# Altium schematic sheet Base_plate.SchDoc
size 420 x 297 mm; SPICEModelCacheWQQPEAYJ: <root> / <DocumentId>WQQPEAYJ</DocumentId> / </root>; ФИО: Соловцов М.А.; название: Плата управления; орг: МГТУ им. Н.Э Баумана; колич: 1; орг1: группа СМ7-71Б; дец: СМ7.00.01.00 Э3
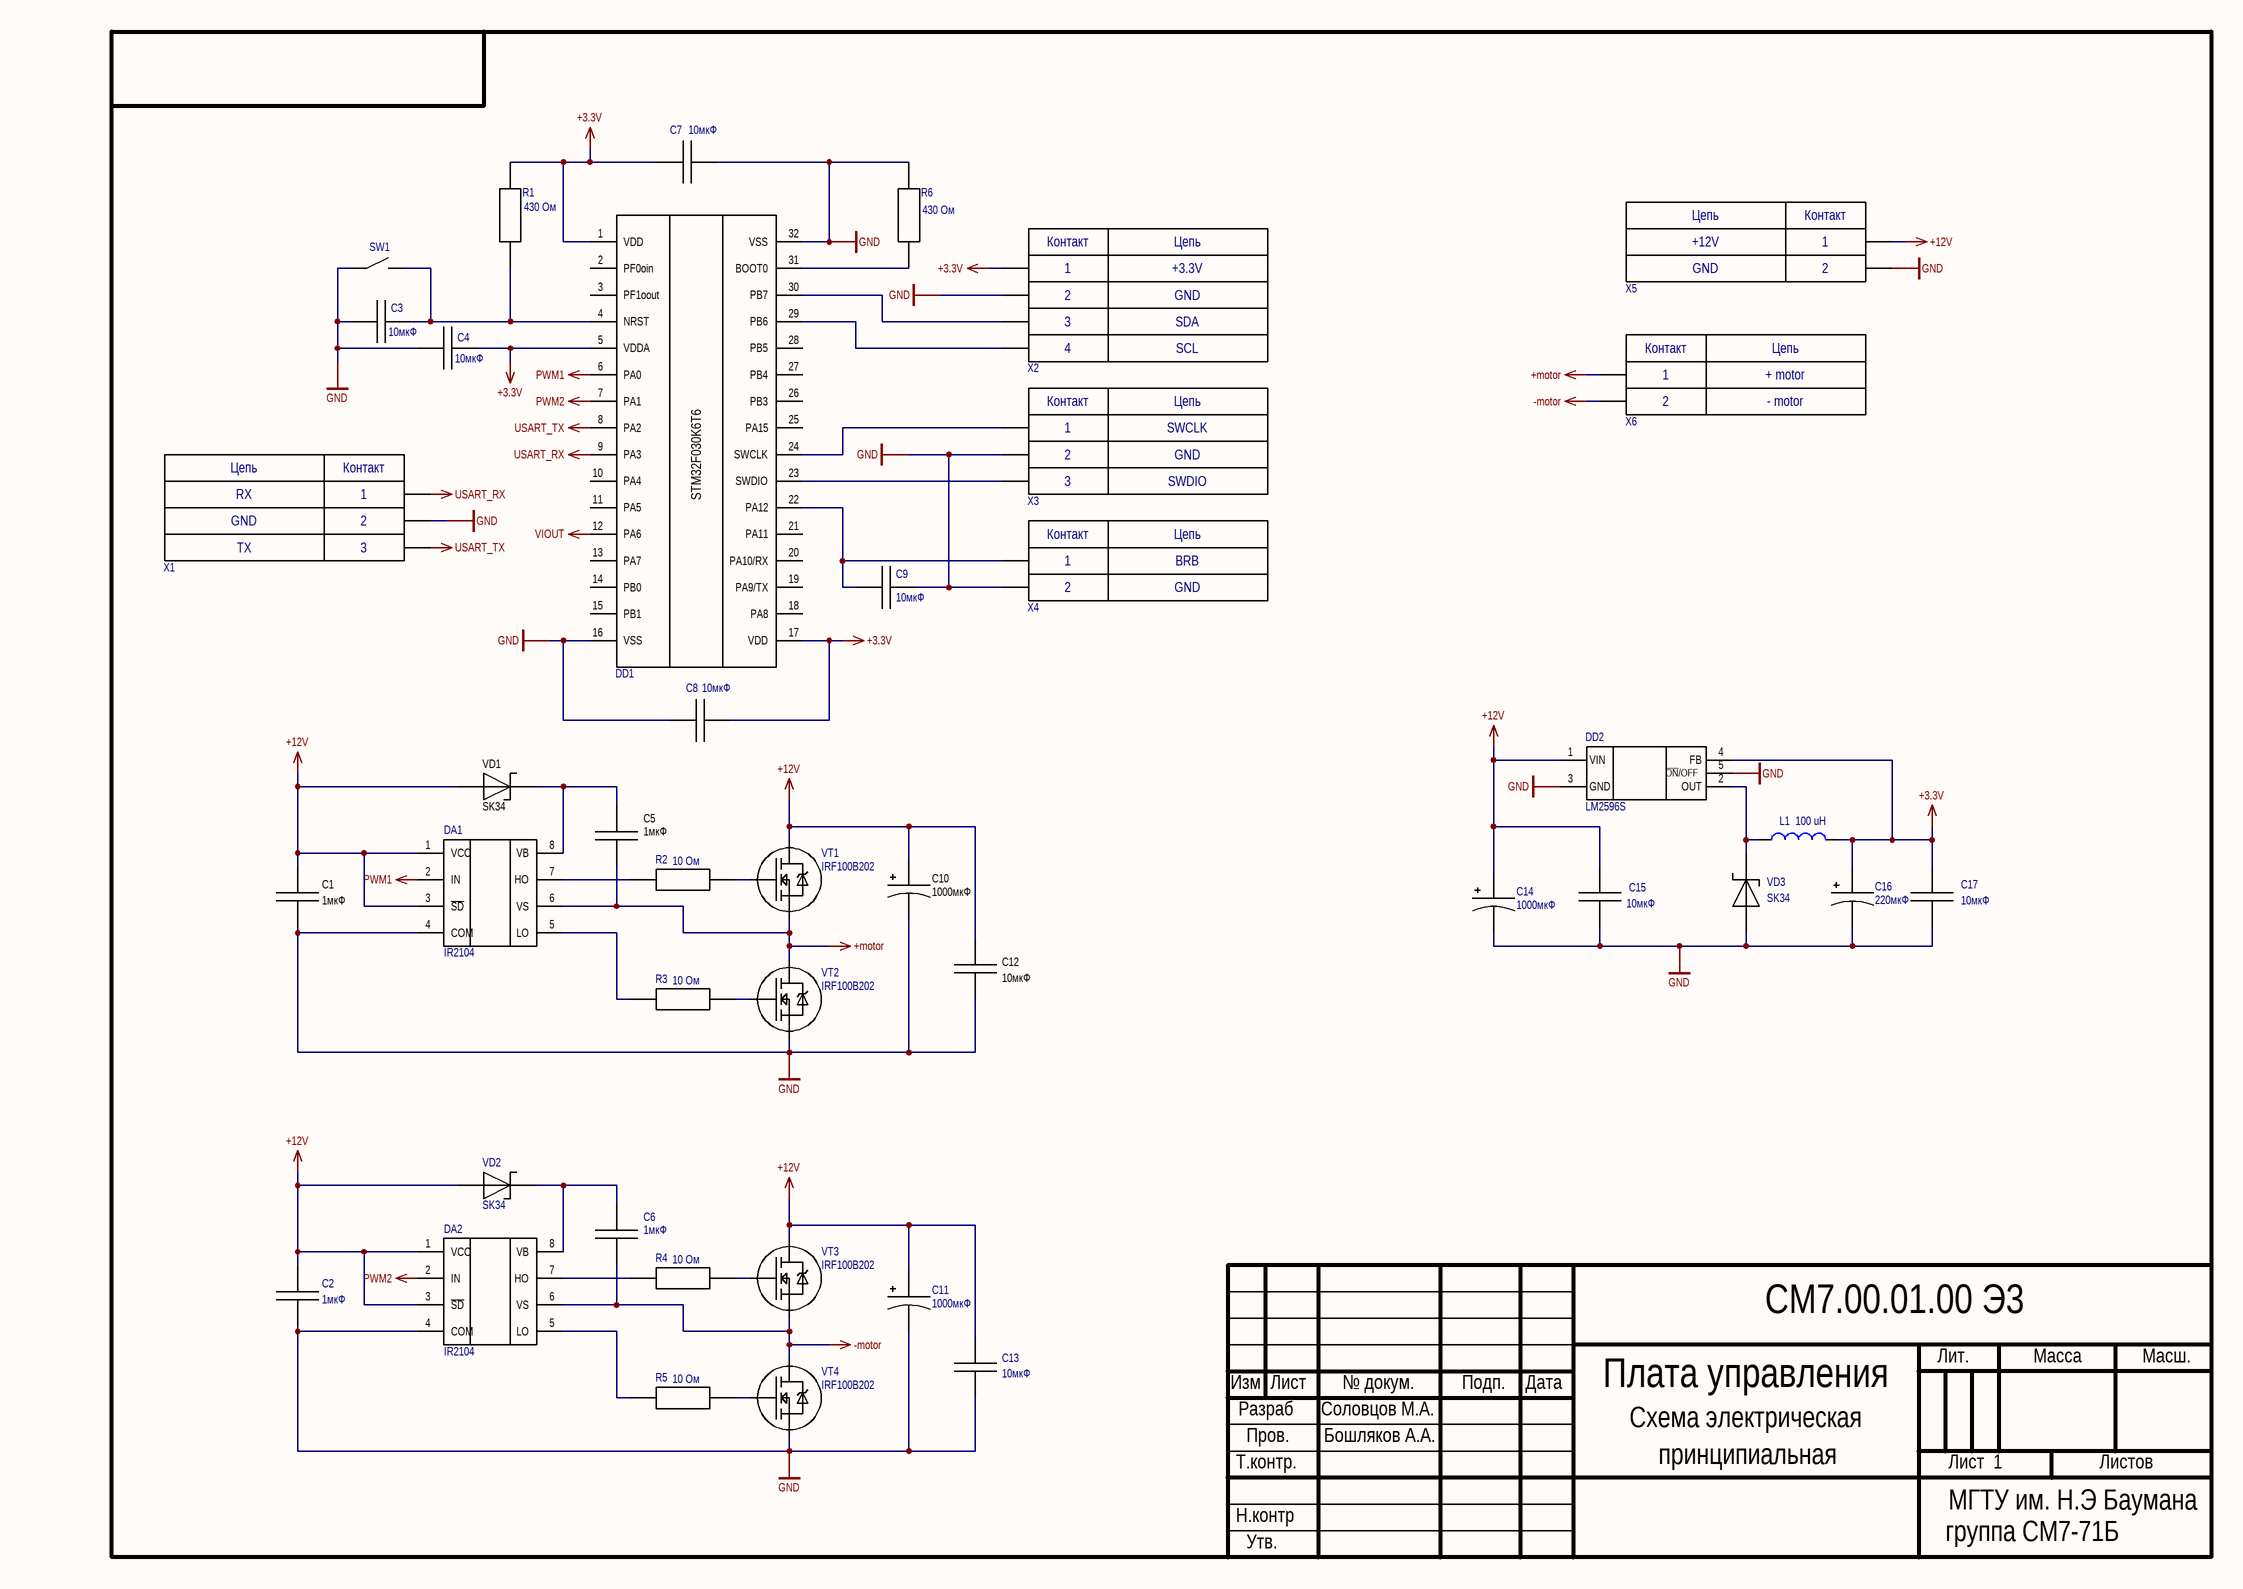
[diagram p0: Base_plate.SchDoc]

## Parts
C1  1мкФ  [CAP 10 uF]
C2  1мкФ  [CAP 10 uF]
C3  10мкФ  [CAP 10 uF]
C4  10мкФ  [CAP 10 uF]
C5  1мкФ  [CAP 10 uF]
C6  1мкФ  [CAP 10 uF]
C7  10мкФ  [CAP 10 uF]
C8  10мкФ  [CAP 10 uF]
C9  10мкФ  [CAP 10 uF]
C10  1000мкФ  [cap 1000]
C11  1000мкФ  [cap 1000]
C12  10мкФ  [CAP 10 uF]
C13  10мкФ  [CAP 10 uF]
C14  1000мкФ  [cap 1000]
C15  10мкФ  [CAP 10 uF]
C16  220мкФ  [Capacitor 220nF E]
C17  10мкФ  [CAP 10 uF]
DA1  IR2104  [IR2104]
DA2  IR2104  [IR2104]
DD1  STM32F030K6T6  [QFP32(7x7)]  (value not drawn)
DD2  LM2596S  [LM2596]
L1  value 100 uH  [INDUCTOR]  (hidden comment: Inductor)
R1  value 430 Ом  [0402]  (hidden comment: 430R)
R2  value 10 Ом  [0402]  (hidden comment: Resistor)
R3  value 10 Ом  [0402]  (hidden comment: Resistor)
R4  value 10 Ом  [0402]  (hidden comment: Resistor)
R5  value 10 Ом  [0402]  (hidden comment: Resistor)
R6  value 430 Ом  [0402]  (hidden comment: 430R)
SW1  Button  [button]  (value not drawn)
VD1  SK34  [SK34]
VD2  SK34  [SK34]
VD3  SK34  [SK34]
VT1  IRF100B202  [TO-220AB]
VT2  IRF100B202  [TO-220AB]
VT3  IRF100B202  [TO-220AB]
VT4  IRF100B202  [TO-220AB]
X1  3pin  [3pin]  (value not drawn)
X2  4pin  [4pin]  (value not drawn)
X3  3pin  [3pin]  (value not drawn)
X4  2pin  [2pin5mmVintKlemm]  (value not drawn)
X5  2pin  [2pin5mmVintKlemm]  (value not drawn)
X6  2pin  [2pin5mmVintKlemm]  (value not drawn)

## Nets
+3.3V: C4.2 C7.1 C8.2 C16.1 C17.1 DD1.1(VDD) DD1.5(VDDA) DD1.17(VDD) DD2.4(FB) L1.2 R1.2 X2.1
+12V: C1.2 C2.2 C10.1 C11.1 C12.1 C13.1 C14.1 C15.1 DA1.1(VCC) DA1.3(~{SD}) DA2.1(VCC) DA2.3(~{SD}) DD2.1(VIN) VD1.1 VD2.1 VT1.2 VT3.2 X5.1
+motor: C5.1 DA1.6(VS) VT1.3 VT2.2 X6.1
-motor: C6.1 DA2.6(VS) VT3.3 VT4.2 X6.2(-Vout)
GND: C1.1 C2.1 C3.1 C4.1 C7.2 C8.1 C9.2 C10.2 C11.2 C12.2 C13.2 C14.2 C15.2 C16.2 C17.2 DA1.4(COM) DA2.4(COM) DD1.16(VSS) DD1.32(VSS) DD2.3(GND) DD2.5(~{ON}/OFF) R6.2 SW1.1(G) VD3.1 VT2.3 VT4.3 X1.2(-Vout) X2.2(-Vout) X3.2(-Vout) X4.2(-Vout) X5.2(-Vout)
PWM1: DA1.2(IN) DD1.6(PA0)
PWM2: DA2.2(IN) DD1.7(PA1)
USART_RX: DD1.9(PA3) X1.1
USART_TX: DD1.8(PA2) X1.3(-Vout)
VIOUT: DD1.12(PA6)
NetC3_2: C3.2 DD1.4(NRST) R1.1 SW1.2(G)
NetC5_2: C5.2 DA1.8(VB) VD1.2
NetC6_2: C6.2 DA2.8(VB) VD2.2
NetC9_1: C9.1 DD1.22(PA12) X4.1
NetDA1_5: DA1.5(LO) R3.1
NetDA1_7: DA1.7(HO) R2.1
NetDA2_5: DA2.5(LO) R5.1
NetDA2_7: DA2.7(HO) R4.1
NetDD1_23: DD1.23(SWDIO) X3.3(-Vout)
NetDD1_24: DD1.24(SWCLK) X3.1
NetDD1_29: DD1.29(PB6) X2.4(-Vout)
NetDD1_30: DD1.30(PB7) X2.3(-Vout)
NetDD1_31: DD1.31(BOOT0) R6.1
NetDD2_2: DD2.2(OUT) L1.1 VD3.2
NetR2_2: R2.2 VT1.1
NetR3_2: R3.2 VT2.1
NetR4_2: R4.2 VT3.1
NetR5_2: R5.2 VT4.1

Not connected (* = marked no-connect by the designer): DD1 2(PF0oin) 3(PF1oout) 10(PA4) 11(PA5) 13(PA7) 14(PB0) 15(PB1) 18(PA8) 19(PA9/TX) 20(PA10/RX) 21(PA11) 25(PA15) 26(PB3) 27(PB4) 28(PB5)

## Notes on the sheet
- Изм
- Лист
- № докум.
- Подп.
- Дата
- Лит.
- Масса
- Масш.
- Т.контр.
- Разраб
- Пров.
- Бошляков А.А.
- Схема электрическая
- принципиальная
- Листов
- Н.контр
- Утв.
- (in symbol 2pin) Контакт; Цепь
- (in symbol 3pin) Контакт; Цепь
- (in symbol 4pin_1) Контакт; Цепь

## Library data of the parts
C1 C2 C5 C6 = Capacitor 0805: GRM21BR71H105K; Parameter 1: *
C3 C4 C7-C9 C12 C13 C15 C17 = Capacitor 0805: 0805X106K350SNT; Parameter 1: *
C10 C11 C14 = Capacitor  El
C16 = CAPACIATOR E D6.3
L1 = Inductor: Code_IEC: 1005; Published: 8-Jun-2000; LatestRevisionDate: 29-May-2009; LatestRevisionNote: IPC-7351 Footprint Added.; PackageReference: 0402-A; Publisher: Altium Limited; PackageDescription: Chip Inductor; Code_JEITA: 0402
R1-R6 = Resistor: TU: ШКАБ.434110.002ТУ; Reference: *
VT1-VT4 = IRF3205PBF: N-Channel 55V 110A _Tc_ 200W _Tc_ Through Hole TO-220AB; MF: Infineon Technologies; Package: TO-220 International Rectifier; MP: IRF3205PBF; Value: *; Availability: Unavailable; Price: None; SnapEDA_Link: https://www.snapeda.com/parts/IRF3205PBF/Infineon%20Technologies/view-part/98571/?ref=snap
X1 = 3pin: LineName1: RX; LineName2: GND; LineName3: TX
X2 = 4pin_1: LineName1: +3.3V; LineName2: GND; LineName3: SDA; LineName4: SCL
X3 = 3pin: LineName1: SWCLK; LineName2: GND; LineName3: SWDIO
X4 = 2pin: LineName1: BRB; LineName2: GND
X5 = 2pin: LineName1: +12V; LineName2: GND
X6 = 2pin: LineName1: + motor; LineName2: - motor